# EAGLE schematic C8 (EAGLE 7.5.0)

## Sheet 1 of 2: Schematic
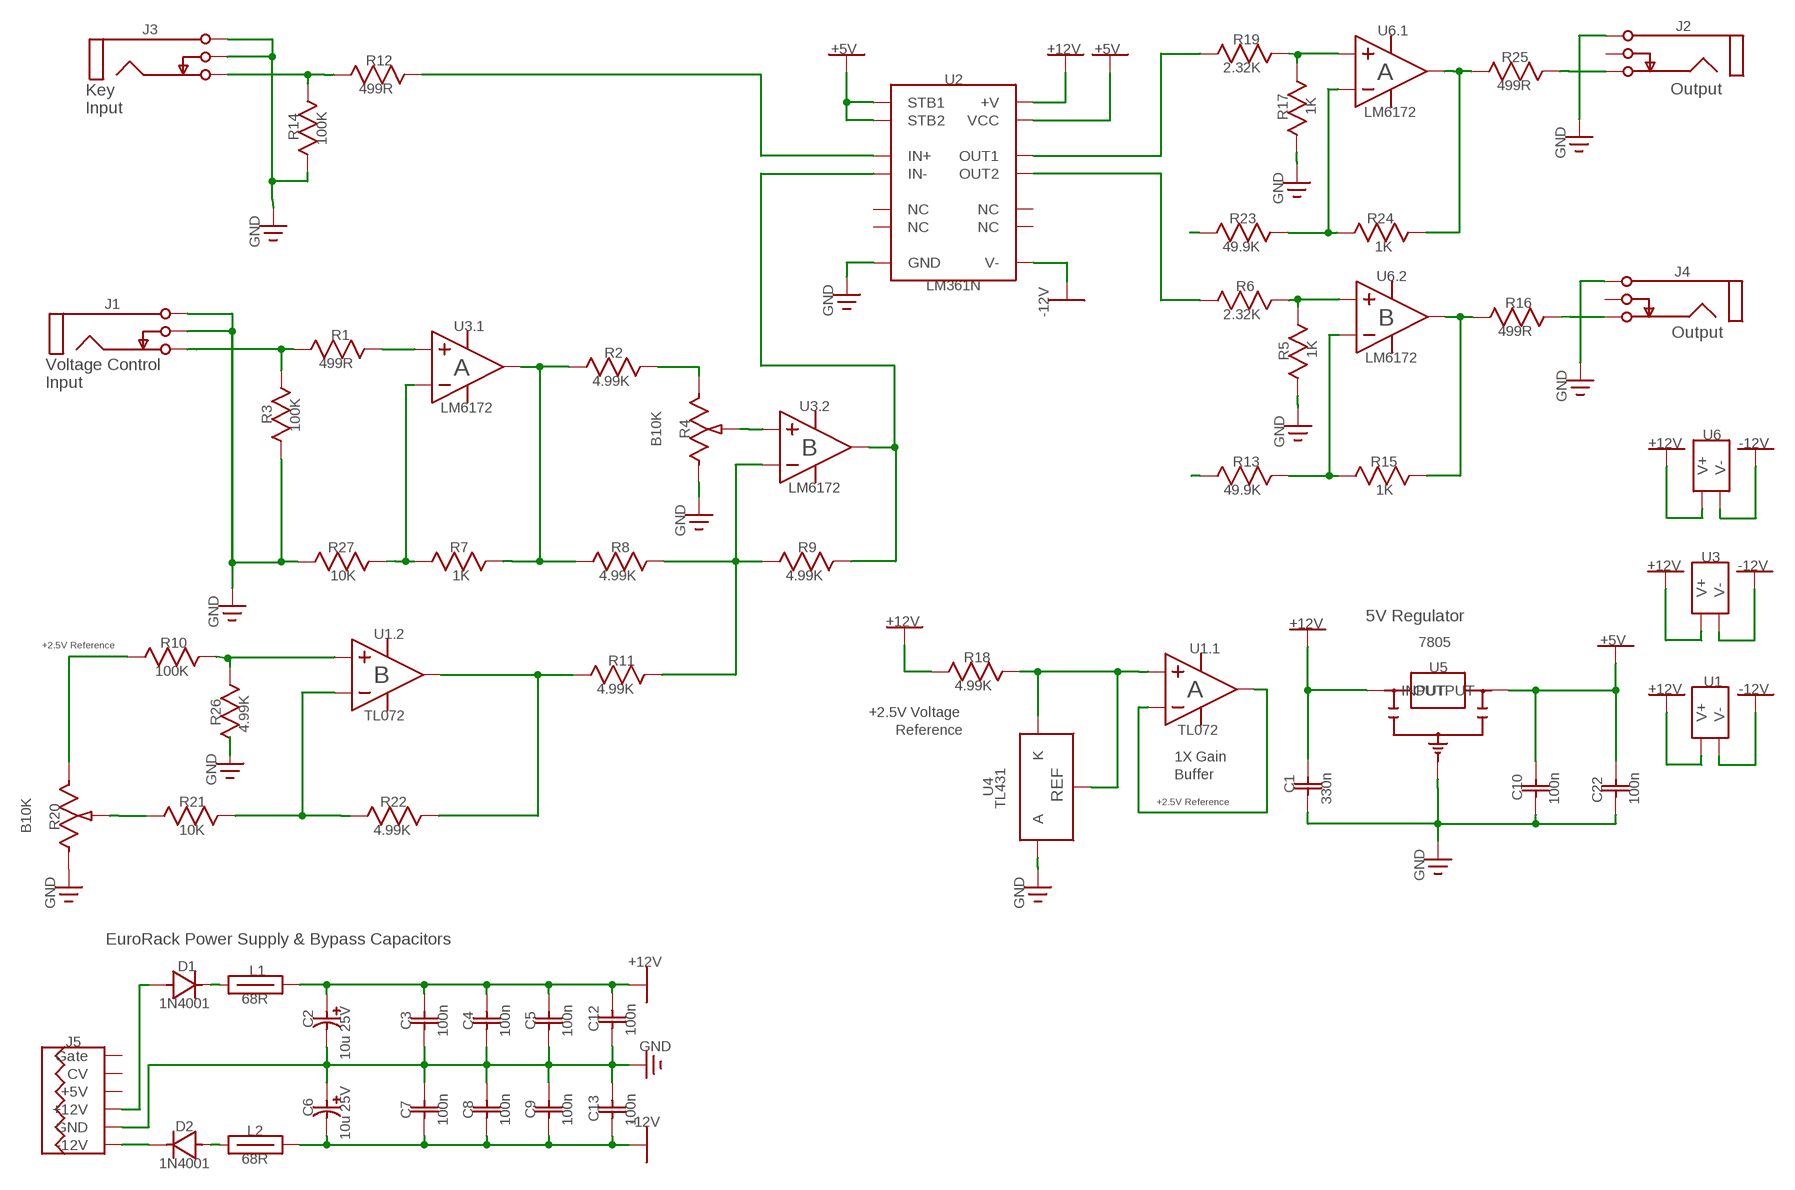
[diagram p0: schematic, sheet 1]

### Parts
C1  330n  CAP100  [CAP-2.54/6.6X3]
C2  10u 25V  EC80-5  [CAPPR-2/5.08]
C3  100n  CAP100  [CAP-2.54/6.6X3]
C4  100n  CAP100  [CAP-2.54/6.6X3]
C5  100n  CAP100  [CAP-2.54/6.6X3]
C6  10u 25V  EC80-5  [CAPPR-2/5.08]
C7  100n  CAP100  [CAP-2.54/6.6X3]
C8  100n  CAP100  [CAP-2.54/6.6X3]
C9  100n  CAP100  [CAP-2.54/6.6X3]
C10  100n  CAP100  [CAP-2.54/6.6X3]
C12  100n  CAP100  [CAP-2.54/6.6X3]
C13  100n  CAP100  [CAP-2.54/6.6X3]
C22  100n  CAP100  [CAP-2.54/6.6X3]
D1  1N4001  [DO-41]
D2  1N4001  [DO-41]
J1  PJ302M  [PJ302M]
J2  PJ302M_1  [PJ302M]
J3  PJ302M  [PJ302M]
J4  PJ302M_1  [PJ302M]
J5  EUROPWR16  [IDC16M]
L1  68R  2743001111  [FB-10.16/4.45X3.5]
L2  68R  2743001111  [FB-10.16/4.45X3.5]
R1  499R  RES300  [RES-7.62/5.1X2.5]
R2  4.99K  RES300  [RES-7.62/5.1X2.5]
R3  100K  RES300  [RES-7.62/5.1X2.5]
R4  B10K  ALPHA9H  [ALPHA9H]
R5  1K  RES300  [RES-7.62/5.1X2.5]
R6  2.32K  RES300  [RES-7.62/5.1X2.5]
R7  1K  RES300  [RES-7.62/5.1X2.5]
R8  4.99K  RES300  [RES-7.62/5.1X2.5]
R9  4.99K  RES300  [RES-7.62/5.1X2.5]
R10  100K  RES300  [RES-7.62/5.1X2.5]
R11  4.99K  RES300  [RES-7.62/5.1X2.5]
R12  499R  RES300  [RES-7.62/5.1X2.5]
R13  49.9K  RES300  [RES-7.62/5.1X2.5]
R14  100K  RES300  [RES-7.62/5.1X2.5]
R15  1K  RES300  [RES-7.62/5.1X2.5]
R16  499R  RES300  [RES-7.62/5.1X2.5]
R17  1K  RES300  [RES-7.62/5.1X2.5]
R18  4.99K  RES300  [RES-7.62/5.1X2.5]
R19  2.32K  RES300  [RES-7.62/5.1X2.5]
R20  B10K  ALPHA9H  [ALPHA9H]
R21  10K  RES300  [RES-7.62/5.1X2.5]
R22  4.99K  RES300  [RES-7.62/5.1X2.5]
R23  49.9K  RES300  [RES-7.62/5.1X2.5]
R24  1K  RES300  [RES-7.62/5.1X2.5]
R25  499R  RES300  [RES-7.62/5.1X2.5]
R26  4.99K  RES300  [RES-7.62/5.1X2.5]
R27  10K  RES300  [RES-7.62/5.1X2.5]
U1  TL072  [DIP-8]
U2  LM361N  [DIP-14]
U3  LM6172  [DIP-8]
U4  TL431  [TO-92-100R]
U5  7805  [TO-220H]
U6  LM6172  [DIP-8]

### Nets
0V: C1.2 C2.2(MINUS) C3.2 C4.2 C5.2 C6.1(PLUS) C7.1 C8.1 C9.1 C10.2 C12.2 C13.1 C22.2 J1.1A(Sleeve) J1.1B(Sleeve) J1.2A(Switch) J1.2B(Switch) J2.1A(Sleeve) J2.1B(Sleeve) J3.1A(Sleeve) J3.1B(Sleeve) J3.2A(Switch) J3.2B(Switch) J4.1A(Sleeve) J4.1B(Sleeve) J5.3(GND) J5.4(GND) J5.5(GND) R3.1(A) R4.1(CCW) R5.1(A) R14.1(A) R17.1(A) R20.1(CCW) R26.1(A) R27.1(A) U2.10(GND) U4.2(A) U5.2(GND) ; supply symbol labelled GND
+2.5V_Reference: R10.1(A) R13.1(A) R20.3(CW) R23.1(A) U1.1(PART_1:OUT) U1.2(PART_1:IN-)
+5V: C10.1 C22.1 U2.8(STB2) U2.13(STB1) U2.14(VCC) U5.3(OUTPUT)
+12V: C1.1 C2.1(PLUS) C3.1 C4.1 C5.1 C12.1 L1.2 R18.2(B) U1.8(VCC_AND_GND:V+) U2.1(+V) U3.8(VCC_AND_GND:V+) U5.1(INPUT) U6.8(VCC_AND_GND:V+)
-12V: C6.2(MINUS) C7.2 C8.2 C9.2 C13.2 L2.2 U1.4(VCC_AND_GND:V-) U2.6(V-) U3.4(VCC_AND_GND:V-) U6.4(VCC_AND_GND:V-)
BIAS_CTRL_BUFFERED: R11.1(A) R22.2(B) U1.7(PART_2:OUT)
BUFFERED_VC_TO_FADER: R9.2(B) U2.3(IN-) U3.7(PART_2:OUT)
Net_0: R10.2(B) R26.2(B) U1.5(PART_2:IN+)
Net_1: D2.2(A) L2.1
Net_2: D1.1(K) L1.1
Net_3: R6.2(B) U2.9(OUT2)
Net_4: R15.2(B) R16.2(B) U6.7(PART_2:OUT)
Net_5: D2.1(K) J5.1(-12V) J5.2(-12V)
Net_6: R17.2(B) R19.1(A) U6.3(PART_1:IN+)
Net_7: R24.2(B) R25.2(B) U6.1(PART_1:OUT)
Net_10: R1.2(B) U3.3(PART_1:IN+)
Net_11: R13.2(B) R15.1(A) U6.6(PART_2:IN-)
Net_12: J2.3A(Tip) J2.3B(Tip) R25.1(A)
Net_13: R23.2(B) R24.1(A) U6.2(PART_1:IN-)
Net_14: R5.2(B) R6.1(A) U6.5(PART_2:IN+)
Net_16: J4.3A(Tip) J4.3B(Tip) R16.1(A)
Net_17: R2.2(B) R4.3(CW)
Net_23: R4.2(W) U3.5(PART_2:IN+)
Net_27: J1.3A(Tip) J1.3B(Tip) R1.1(A) R3.2(B)
Net_28: R20.2(W) R21.1(A)
Net_32: R12.2(B) U2.4(IN+)
Net_33: D1.2(A) J5.9(+12V) J5.10(+12V)
Net_34: R19.2(B) U2.11(OUT1)
Net_50: R18.1(A) U1.3(PART_1:IN+) U4.1(K) U4.3(REF)
Net_52: R7.1(A) R27.2(B) U3.2(PART_1:IN-)
Net_53: R2.1(A) R7.2(B) R8.1(A) U3.1(PART_1:OUT)
Net_54: R8.2(B) R9.1(A) R11.2(B) U3.6(PART_2:IN-)
Net_60: R21.2(B) R22.1(A) U1.6(PART_2:IN-)
Net_64: J3.3A(Tip) J3.3B(Tip) R12.1(A) R14.2(B)
Unconnected: J2.2A(Switch) J2.2B(Switch) J4.2A(Switch) J4.2B(Switch) J5.11(+5V) J5.12(+5V) J5.13(CV) J5.14(CV) J5.15(Gate) J5.16(Gate) U2.2(NC) U2.5(NC) U2.7(NC) U2.12(NC)

### Notes on the sheet
- J3 | J2
- U6.1
- R19
- +5V | +12V | +5V
- R12 | 2.32K | A | R25
- Key | 499R | 499R | Output
- U2
- Input
- LM6172
- 1K
- R17
- R14
- 100K
- GND
- GND
- R23 | R24
- 49.9K | 1K
- GND
- LM361N | J4
- U6.2
- R6
- J1 | 2.32K | B | R16
- GND | -12V
- 499R | Output
- U3.1
- R1
- LM6172
- Voltage Control | 499R | A | R2 | R5 | 1K
- Input | 4.99K
- LM6172 | GND
- U3.2
- R3
- 100K
- R4 | B | U6
- B10K | GND | +12V | -12V
- R13 | R15
- LM6172 | 49.9K | 1K
- GND
- R27 | R7 | R8 | R9
- U3
- 10K | 1K | 4.99K | 4.99K | +12V | -12V
- 5V Regulator
- GND | +12V | +12V
- U1.2 | 7805
- +2.5V Reference
- R10 | +5V
- U1.1
- 100K | B | R11 | R18
- U5
- 4.99K | 4.99K | A
- U1
- +12V | -12V
- TL072 | +2.5V Voltage
- R26 | Reference | TL072
- 4.99K
- 1X Gain
- Buffer
- GND
- U4 | C1
- +2.5V Reference | C10
- REF | 330n | 100n | C22 | 100n
- R21 | R22 | TL431
- 10K | 4.99K
- B10K | R20
- GND
- GND | GND
- EuroRack Power Supply & Bypass Capacitors
- +12V
- D1
- L1
- 68R
- 1N4001
- C2 | C3 | C4 | C5 | C12
- 100n | 100n | 100n | 100n
- J5
- GND
- 10u 25V
- C6 | C7 | C8 | C9
- 100n | 100n | 100n | C13
- 100n | -12V
- D2
- L2 | 10u 25V
- 68R
- 1N4001

## Sheet 2 of 2: BOM
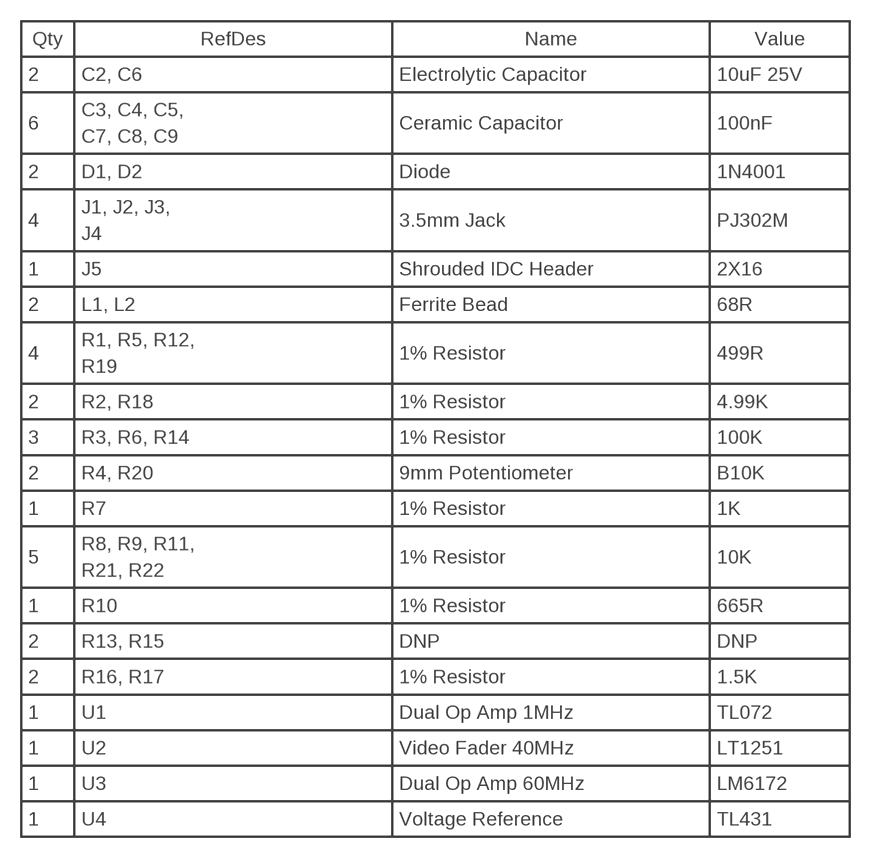
[diagram p1: schematic, sheet 2]

### Notes on the sheet
- Qty | RefDes | Name | Value
- 2 | C2, C6 | Electrolytic Capacitor | 10uF 25V
- 6
- C3, C4, C5,
  C7, C8, C9
- Ceramic Capacitor | 100nF
- 2 | D1, D2 | Diode | 1N4001
- 4
- J1, J2, J3,
  J4
- 3.5mm Jack | PJ302M
- 1 | J5 | Shrouded IDC Header | 2X16
- 2 | L1, L2 | Ferrite Bead | 68R
- 4
- R1, R5, R12,
  R19
- 1% Resistor | 499R
- 2 | R2, R18 | 1% Resistor | 4.99K
- 3 | R3, R6, R14 | 1% Resistor | 100K
- 2 | R4, R20 | 9mm Potentiometer | B10K
- 1 | R7 | 1% Resistor | 1K
- 5
- R8, R9, R11,
  R21, R22
- 1% Resistor | 10K
- 1 | R10 | 1% Resistor | 665R
- 2 | R13, R15 | DNP | DNP
- 2 | R16, R17 | 1% Resistor | 1.5K
- 1 | U1 | Dual Op Amp 1MHz | TL072
- 1 | U2 | Video Fader 40MHz | LT1251
- 1 | U3 | Dual Op Amp 60MHz | LM6172
- 1 | U4 | Voltage Reference | TL431

## Library data of the parts
C1 = common:CAP100; VALUE: 100n
C2 C6 = common:EC80-5
C3-C5 C7-C10 C12 C13 C22 = common:CAP100
D1 D2 = common:1N4001
J1 J3 = common:PJ302M; DATASHEET: http://www.thonk.co.uk/shop/pj302m/
J2 J4 = common:PJ302M_1; DATASHEET: http://www.thonk.co.uk/shop/pj302m/
J5 = common:EUROPWR16
L1 L2 = common:2743001111; MANUFACTURER: Fair-Rite
R1 R2 R5-R9 R11-R13 R15-R19 R21-R27 = common:RES300; VALUE: 100K
R3 R10 R14 = common:RES300
R4 R20 = common:ALPHA9H; DATASHEET: http://www.thonk.co.uk/shop/alpha-9mm-pots/; MANUFACTURER: Alpha
U1 = common:TL072; DATASHEET: http://datasheets.diptrace.com\ti\TL07x.pdf; MANUFACTURER: Texas Instruments
U2 = common:LM361N; MANUFACTURER: National Semiconductor
U3 U6 = common:LM6172; DATASHEET: http://www.ti.com/lit/gpn/lm6172; MANUFACTURER: Texas Instruments
U4 = common:TL431; DATASHEET: http://datasheets.diptrace.com\st_micro\CD00000986.pdf; MANUFACTURER: ST Microelectronics
U5 = common:7805; MANUFACTURER: Atmel